# EAGLE design master (EAGLE 8.5.2)
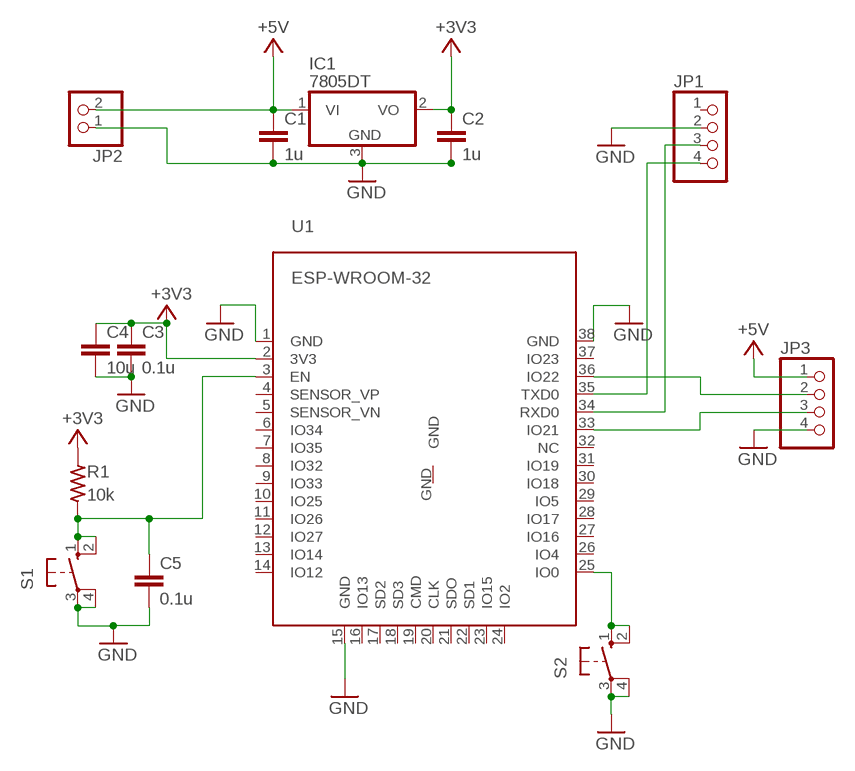
[diagram p0: schematic, sheet 1]

## Parts
C1  1u  C-EUC1608  [C1608]
C2  1u  C-EUC1608  [C1608]
C3  0.1u  C-EUC1608  [C1608]
C4  10u  C-EUC1608  [C1608]
C5  0.1u  C-EUC1608  [C1608]
IC1  7805DT  [TO252]
JP1  PINHD-1X4  [1X04]
JP2  PINHD-1X2  [1X02]
JP3  PINHD-1X4  [1X04]
R1  10k  RESISTOR-US1608  [SMD1608]
S1  10-XX  [B3F-10XX]
S2  10-XX  [B3F-10XX]
U1  ESP-WROOM-32  [ESP-WROOM-32]

## Nets
+3V3: C2.1 C3.1 C4.1 IC1.2(VO) R1.1 U1.2(3V3)
+5V: C1.1 IC1.1(VI) JP2.2 JP3.1
GND: C1.2 C2.2 C3.2 C4.2 C5.2 IC1.3(GND) JP1.2 JP2.1 JP3.4 S1.3(P) S1.4(P1) S2.3(P) S2.4(P1) U1.1(GND) U1.15(GND) U1.38(GND)
N$5: JP1.3 U1.34(RXD0)
N$6: JP1.4 U1.35(TXD0)
N$8: S2.1(S) S2.2(S1) U1.25(IO0)
N$11: C5.1 R1.2 S1.1(S) S1.2(S1) U1.3(EN)
N$12: JP3.2 U1.36(IO22)
N$13: JP3.3 U1.33(IO21)
Unconnected: JP1.1 U1.4(SENSOR_VP) U1.5(SENSOR_VN) U1.6(IO34) U1.7(IO35) U1.8(IO32) U1.9(IO33) U1.10(IO25) U1.11(IO26) U1.12(IO27) U1.13(IO14) U1.14(IO12) U1.16(IO13) U1.17(SD2) U1.18(SD3) U1.19(CMD) U1.20(CLK) U1.21(SDO) U1.22(SD1) U1.23(IO15) U1.24(IO2) U1.26(IO4) U1.27(IO16) U1.28(IO17) U1.29(IO5) U1.30(IO18) U1.31(IO19) U1.32(NC) U1.37(IO23) U1.GND

## Library data of the parts
C1-C5 = rcl:C-EU: CAPACITOR, European symbol; SPICEPREFIX: C
IC1 = linear:78*: Positive VOLTAGE REGULATOR Source: http://cache.national.com/ds/LM/LM78L05.pdf http://www.fairchildsemi.com/ds/LM/LM7805.pdf
JP1 JP3 = pinhead:PINHD-1X4: PIN HEADER
JP2 = pinhead:PINHD-1X2: PIN HEADER
R1 = generic:RESISTOR-US: Generic Registor
S1 S2 = switch-omron:10-XX: OMRON SWITCH; MPN: B3F-1000; OC_FARNELL: 176432; OC_NEWARK: 36M3542
U1 = esp32:ESP-WROOM-32

## Board
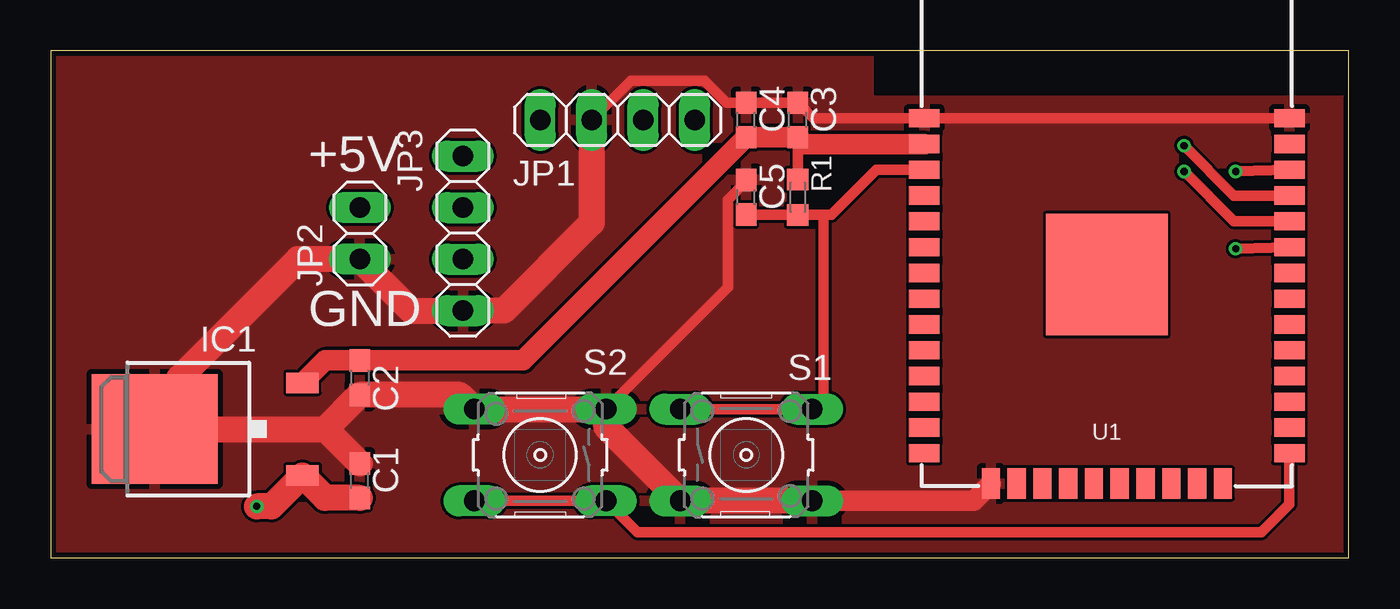
[diagram p1: board, top side]
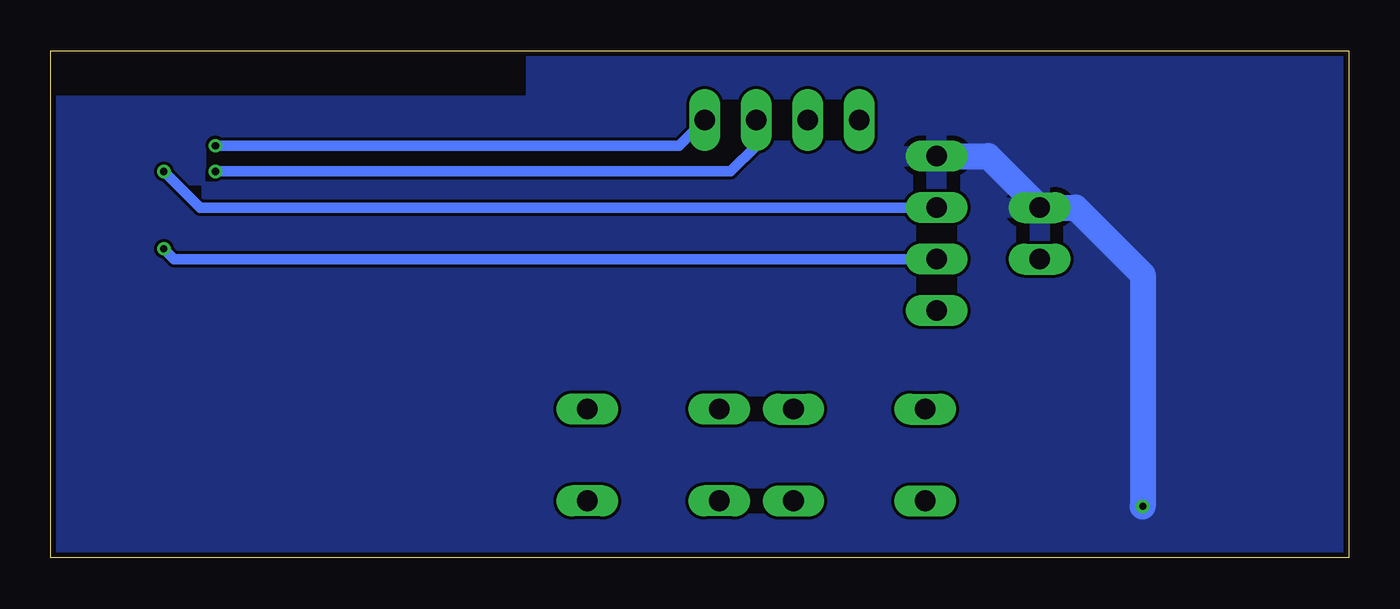
[diagram p2: board, bottom side, seen from below]

Size 64 x 25 mm. Coordinates in mm from the lower left corner, seen from the top.
Outline: 0,0 64,0 64,25 0,25 0,0
Copper layers (1*16): Top 0.035mm / dielectric 1.5mm / Bottom 0.035mm
Design rules "SeeedStudio_2layer_DRU_no_angle_20140221": minimum track width 6mil, minimum drill 12mil, track to track 6mil, track to pad 6mil, pad to pad 6mil, via to via 6mil, smd to smd 0mil, copper to edge 10mil, drill to drill 10mil, minimum pad ring 10mil, minimum via ring 6mil, stop-mask expansion 2mil, vias tented up to drill 100mil, thermal gap 10mil

### Footprints (pad centres in the part's own frame; a part is rotated, then mirrored left to right if it is on the bottom)
C1608 = smd 1.1 x 1: 1 -0.85,0; 2 0.85,0
TO252 = smd 1 x 1.6: 1 -2.28,-4.8; 2 2.28,-4.8 | smd 5.4 x 6.2: 3 0,2.5
1X04 = drill 1.016 long: 1 -3.81,0; 2 -1.27,0; 3 1.27,0; 4 3.81,0
1X02 = drill 1.016 long: 1 -1.27,0; 2 1.27,0
SMD1608 = smd 1.05 x 1.08: 1 -0.875,0; 2 0.875,0
B3F-10XX = drill 1.016 long: 1 -3.251,2.261; 2 3.251,2.261; 3 -3.251,-2.261; 4 3.251,-2.261
ESP-WROOM-32 = smd 0.9 x 1.5: 1 7.7,9; 2 6.43,9; 3 5.16,9; 4 3.89,9; 5 2.62,9; 6 1.35,9; 7 0.08,9; 8 -1.19,9; 9 -2.46,9; 10 -3.73,9; 11 -5,9; 12 -6.27,9; 13 -7.54,9; 14 -8.81,9; 25 -8.81,-9; 26 -7.54,-9; 27 -6.27,-9; 28 -5,-9; 29 -3.73,-9; 30 -2.46,-9; 31 -1.19,-9; 32 0.08,-9; 33 1.35,-9; 34 2.62,-9; 35 3.89,-9; 36 5.16,-9; 37 6.43,-9; 38 7.7,-9 | smd 1.5 x 0.9: 15 -10.3,5.715; 16 -10.3,4.445; 17 -10.3,3.175; 18 -10.3,1.905; 19 -10.3,0.635; 20 -10.3,-0.635; 21 -10.3,-1.905; 22 -10.3,-3.175; 23 -10.3,-4.445; 24 -10.3,-5.715 | smd 6 x 6: GND 0,0

### Placement (x,y rotation side)
C1  15.24,3.81 90 top
C2  15.24,8.89 270 top
C3  36.83,21.59 90 top
C4  34.29,21.59 90 top
C5  34.29,17.78 90 top
IC1  7.62,6.35 90 top
JP1  27.94,21.59 0 top
JP2  15.24,16 90 top
JP3  20.32,16 270 top
R1  36.83,17.78 270 top
S1  34.29,5.08 0 top
S2  24.13,5.08 180 top
U1  52.07,13.97 90 top

### Tracks (layer width: path | path; a pad name or v marks a point on that pad's centre or on a via)
+3V3
  Top 0.508: R1.1 C3.1
  Top 1.016: U1.2 37.17,20.4 C3.1 C4.1 23.29,9.74 C2.1 13.53,9.74 IC1.2
+5V  (via drill 0.35)
  Top 1.27: v10.16,2.54 10.89,2.54 IC1.1 13.53,2.96 C1.1
  Bottom 1.27: v10.16,2.54 10.16,13.97 13.46,17.27 JP2.2 17.78,19.81 JP3.1
  pour Bottom: 0,0 64.77,0 64.77,25.4 0,25.4
GND
  Top 0.508: U1.38 U1.1 37.6,21.67 C3.2 C4.2 33.31,22.44 32.23,23.52 28.6,23.52 JP1.2 | C5.2 34.29,18.55 33.38,17.65 33.38,13.34 S2.3
  Top 1.016: S1.4 45.5,2.82 U1.15
  Top 1.27: IC1.3 6.35,6.35 | 6.35,6.35 13.55,6.35 | 13.55,6.35 C2.2 20.18,8.04 S2.4 S2.3 27.38,6.48 S1.3 S1.4 | JP1.2 26.67,16.51 22.35,12.19 JP3.4 17.78,12.19 JP2.1 12.19,14.73 6.35,8.89 6.35,6.35 | 13.55,6.35 C1.2
  pour Top: 0,0 64.77,0 64.77,25.4 0,25.4
N$5  (via drill 0.35)
  Top 0.508: U1.34 58.34,16.59 v55.88,19.05
  Bottom 0.508: JP1.3 29.21,20.32 30.48,19.05 v55.88,19.05
N$6  (via drill 0.35)
  Top 0.508: U1.35 58.34,17.86 v55.88,20.32
  Bottom 0.508: v55.88,20.32 33.02,20.32 JP1.4
N$8
  Top 0.508: S2.2 S2.1 28.93,1.27 59.69,1.27 61.07,2.65 U1.25
N$11
  Top 0.508: C5.1 34.31,16.91 R1.2 38.1,16.91 | U1.3 40.72,19.13 38.49,16.91 38.1,16.91 | S1.1 S1.2 38.1,7.9 38.1,16.91
N$12  (via drill 0.35)
  Top 0.508: v58.42,19.05 58.45,19.05 U1.36
  Bottom 0.508: JP3.2 56.64,17.27 v58.42,19.05
N$13  (via drill 0.35)
  Top 0.508: v58.42,15.24 58.45,15.24 U1.33
  Bottom 0.508: JP3.3 35.56,14.73 57.91,14.73 v58.42,15.24

### Text on the board
tNames: +5V | GND